# EAGLE design PIC32MX250F128B (EAGLE 8.1.0)
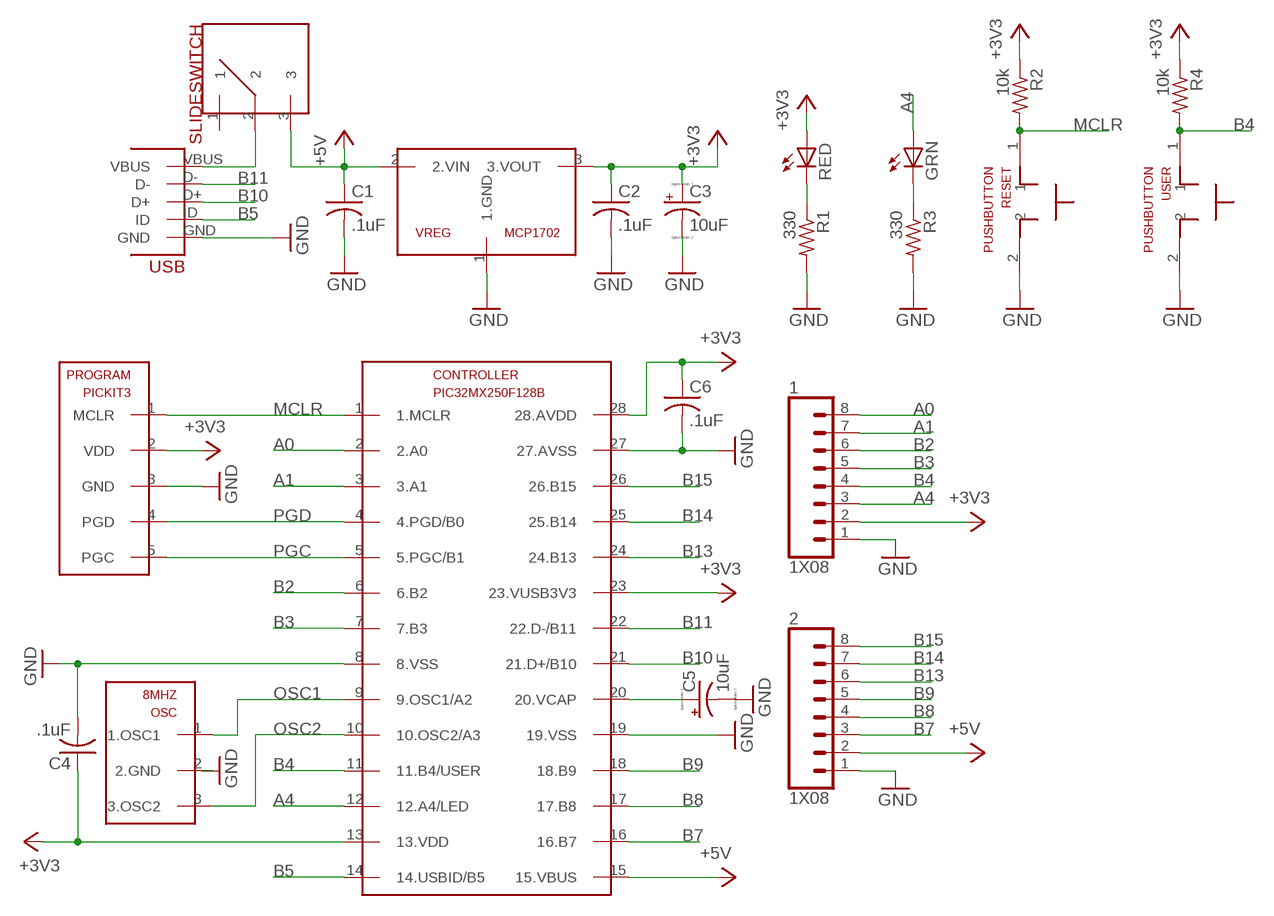
[diagram p0: schematic, sheet 1]

## Parts
1  1X08  [CONN_08]
2  1X08  [CONN_08]
8MHZ  OSC  [OSC]
C1  .1uF  C-US025-025X050  [C025-025X050]
C2  .1uF  C-US025-025X050  [C025-025X050]
C3  10uF  CPOL-USB45181B  [B45181B]
C4  .1uF  C-US025-025X050  [C025-025X050]
C5  10uF  CPOL-USB45181B  [B45181B]
C6  .1uF  C-US025-025X050  [C025-025X050]
CONTROLLER  PIC32MX250F128B  [DIL28-3]
GRN  LED3MM  [LED3MM]
PROGRAM  PICKIT3  [PICKIT3]
R1  330  R-US_0207/10  [0207/10]
R2  10k  R-US_0207/10  [0207/10]
R3  330  R-US_0207/10  [0207/10]
R4  10k  R-US_0207/10  [0207/10]
RED  LED3MM  [LED3MM]
RESET  PUSHBUTTON  [PUSHBUTTON]
SLIDESWITCH  SLIDESWITCH  [SLIDESWITCH]
USB  MINIUSB  [USB-MB-H]
USER  PUSHBUTTON  [PUSHBUTTON]
VREG  MCP1702  [TO92]

## Nets
+3V3: 1.2 C2.1 C3.+ C4.1 C6.1 CONTROLLER.13(13.VDD) CONTROLLER.23(23.VUSB3V3) CONTROLLER.28(28.AVDD) PROGRAM.2(VDD) R2.1 R4.1 RED.A VREG.3(3.VOUT)
+5V: 2.2 C1.1 CONTROLLER.15(15.VBUS) SLIDESWITCH.3 VREG.2(2.VIN)
A0: 1.8 CONTROLLER.2(2.A0)
A1: 1.7 CONTROLLER.3(3.A1)
A4: 1.3 CONTROLLER.12(12.A4/LED) GRN.A
B2: 1.6 CONTROLLER.6(6.B2)
B3: 1.5 CONTROLLER.7(7.B3)
B4: 1.4 CONTROLLER.11(11.B4/USER) R4.2 USER.1
B5: CONTROLLER.14(14.USBID/B5) USB.ID
B7: 2.3 CONTROLLER.16(16.B7)
B8: 2.4 CONTROLLER.17(17.B8)
B9: 2.5 CONTROLLER.18(18.B9)
B10: CONTROLLER.21(21.D+/B10) USB.D+
B11: CONTROLLER.22(22.D-/B11) USB.D-
B13: 2.6 CONTROLLER.24(24.B13)
B14: 2.7 CONTROLLER.25(25.B14)
B15: 2.8 CONTROLLER.26(26.B15)
GND: 1.1 2.1 8MHZ.2(2.GND) C1.2 C2.2 C3.- C4.2 C5.- C6.2 CONTROLLER.8(8.VSS) CONTROLLER.19(19.VSS) CONTROLLER.27(27.AVSS) PROGRAM.3(GND) R1.2 R3.2 RESET.2 USB.GND USER.2 VREG.1(1.GND)
MCLR: CONTROLLER.1(1.MCLR) PROGRAM.1(MCLR) R2.2 RESET.1
N$2: R1.1 RED.K(C)
N$4: GRN.K(C) R3.1
OSC1: 8MHZ.1(1.OSC1) CONTROLLER.9(9.OSC1/A2)
OSC2: 8MHZ.3(3.OSC2) CONTROLLER.10(10.OSC2/A3)
PGC: CONTROLLER.5(5.PGC/B1) PROGRAM.5(PGC)
PGD: CONTROLLER.4(4.PGD/B0) PROGRAM.4(PGD)
VBUS: SLIDESWITCH.2 USB.VBUS
VCAP: C5.+ CONTROLLER.20(20.VCAP)
Unconnected: SLIDESWITCH.1

## Library data of the parts
1 2 = HW2:1X08
8MHZ = HW2:OSC
C1 C2 C4 C6 = HW2:C-US: CAPACITOR, American symbol
C3 C5 = HW2:CPOL-US: POLARIZED CAPACITOR, American symbol
CONTROLLER = HW2:PIC32MX250F128B
GRN RED = HW2:LED: LED OSRAM: - CHIPLED LG R971, LG N971, LY N971, LG Q971, LY Q971, LO R971, LY R971 LH N974, LH R974 LS Q976, LO Q976, LY Q976 LO Q996 - Hyper CHIPLED LW Q18S LB Q993, LB Q99A, LB R99A - SideLED LS A670, LO A670, LY A670, LG A670, LP A670 LB A673, LV A673, LT A673, LW A673 LH A674 LY A675 LS A676, LA A676, LO A676, LY A676, LW A676 LS A679, LY A679, LG A679 - Hyper Micro SIDELED® LS Y876, LA Y876, LO Y876, LY Y876 LT Y87S - SmartLED LW L88C, LW L88S LB L89C, LB L89S, LG L890 LS L89K, LO L89K, LY L89K LS L896, LA L896, LO L896, LY L896 - TOPLED LS T670, LO T670, LY T670, LG T670, LP T670 LSG T670, LSP T670, LSY T670, LOP T670, LYG T670 LG T671, LOG T671, LSG T671 LB T673, LV T673, LT T673, LW T673 LH T674 LS T676, LA T676, LO T676, LY T676, LB T676, LH T676, LSB T676, LW T676 LB T67C, LV T67C, LT T67C, LS T67K, LO T67K, LY T67K, LW E67C LS E67B, LA E67B, LO E67B, LY E67B, LB E67C, LV E67C, LT E67C LW T67C LS T679, LY T679, LG T679 LS T770, LO T770, LY T770, LG T770, LP T770 LB T773, LV T773, LT T773, LW T773 LH T774 LS E675, LA E675, LY E675, LS T675 LS T776, LA T776, LO T776, LY T776, LB T776 LHGB T686 LT T68C, LB T68C - Hyper Mini TOPLED® LB M676 - Mini TOPLED Santana® LG M470 LS M47K, LO M47K, LY M47K Source: http://www.osram.convergy.de LUXEON: - LUMILED® LXK2-PW12-R00, LXK2-PW12-S00, LXK2-PW14-U00, LXK2-PW14-V00 LXK2-PM12-R00, LXK2-PM12-S00, LXK2-PM14-U00 LXK2-PE12-Q00, LXK2-PE12-R00, LXK2-PE12-S00, LXK2-PE14-T00, LXK2-PE14-U00 LXK2-PB12-K00, LXK2-PB12-L00, LXK2-PB12-M00, LXK2-PB14-N00, LXK2-PB14-P00, LXK2-PB14-Q00 LXK2-PR12-L00, LXK2-PR12-M00, LXK2-PR14-Q00, LXK2-PR14-R00 LXK2-PD12-Q00, LXK2-PD12-R00, LXK2-PD12-S00 LXK2-PH12-R00, LXK2-PH12-S00 LXK2-PL12-P00, LXK2-PL12-Q00, LXK2-PL12-R00 Source: www.luxeon.com KINGBRIGHT: KA-3528ASYC Source: www.kingbright.com
PROGRAM = HW2:PICKIT3
R1-R4 = HW2:R-US_: RESISTOR, American symbol
RESET USER = HW2:PUSHBUTTON
SLIDESWITCH = HW2:SLIDESWITCH
USB = HW2:MINIUSB
VREG = HW2:MCP1702

## Board
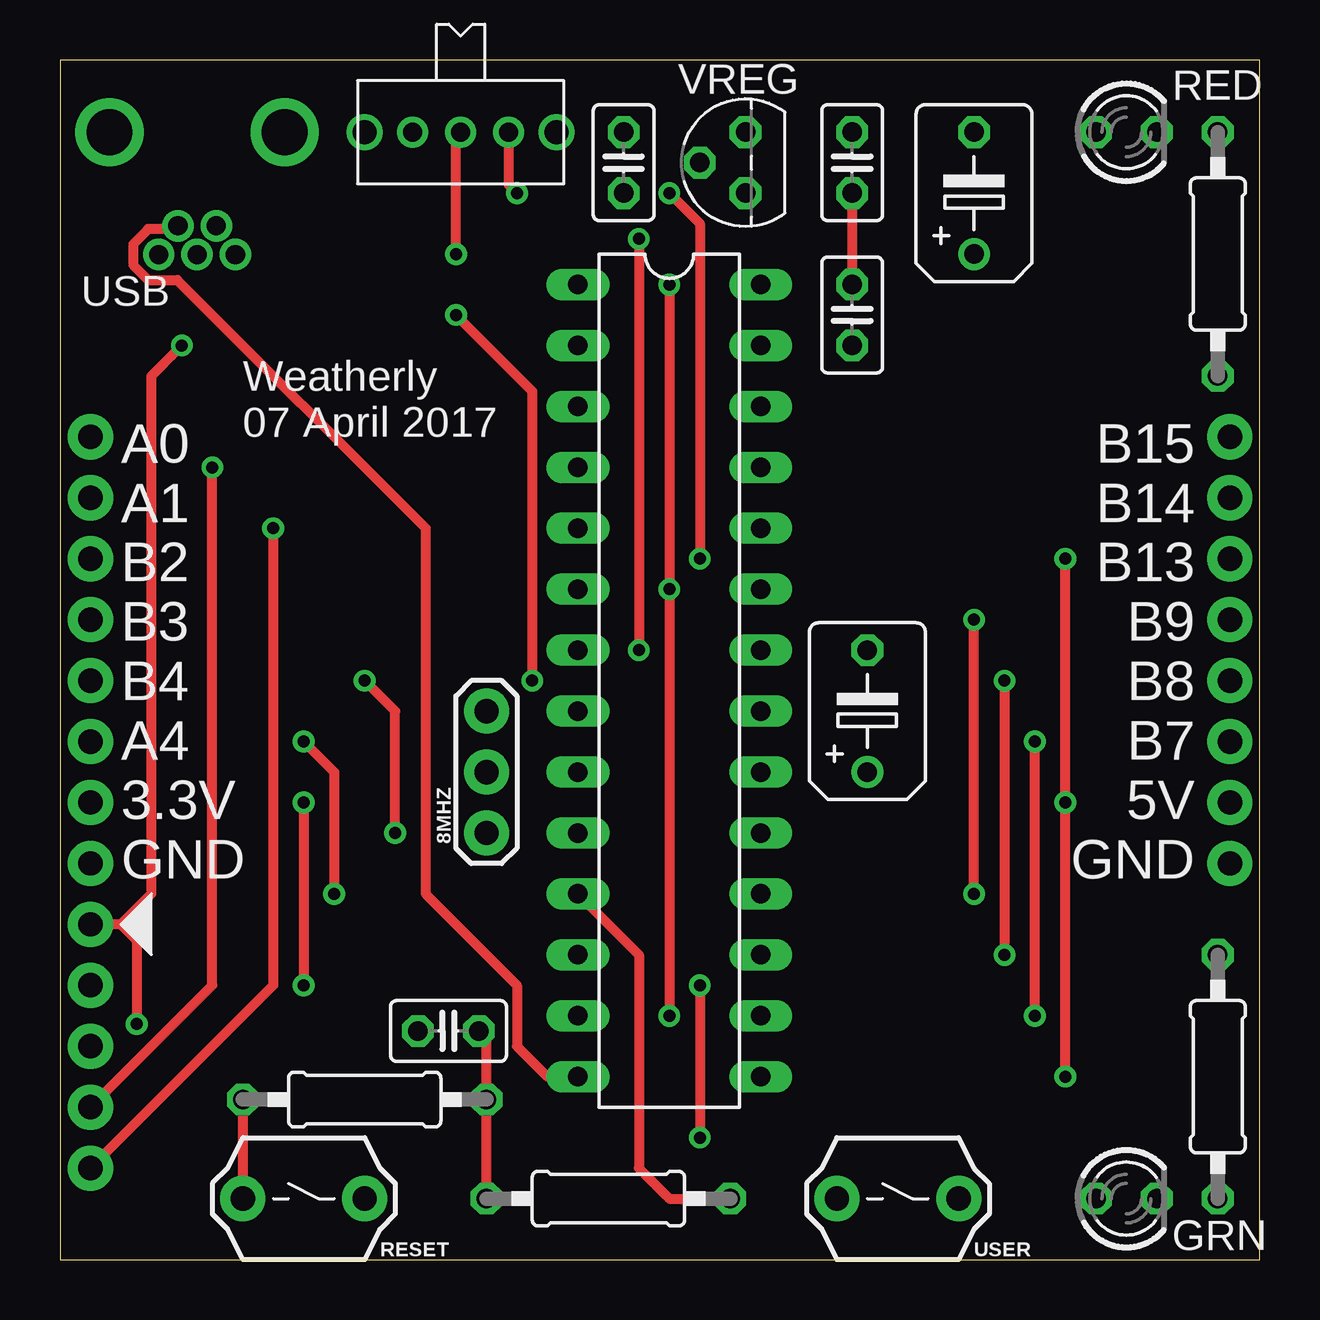
[diagram p1: board, top side]
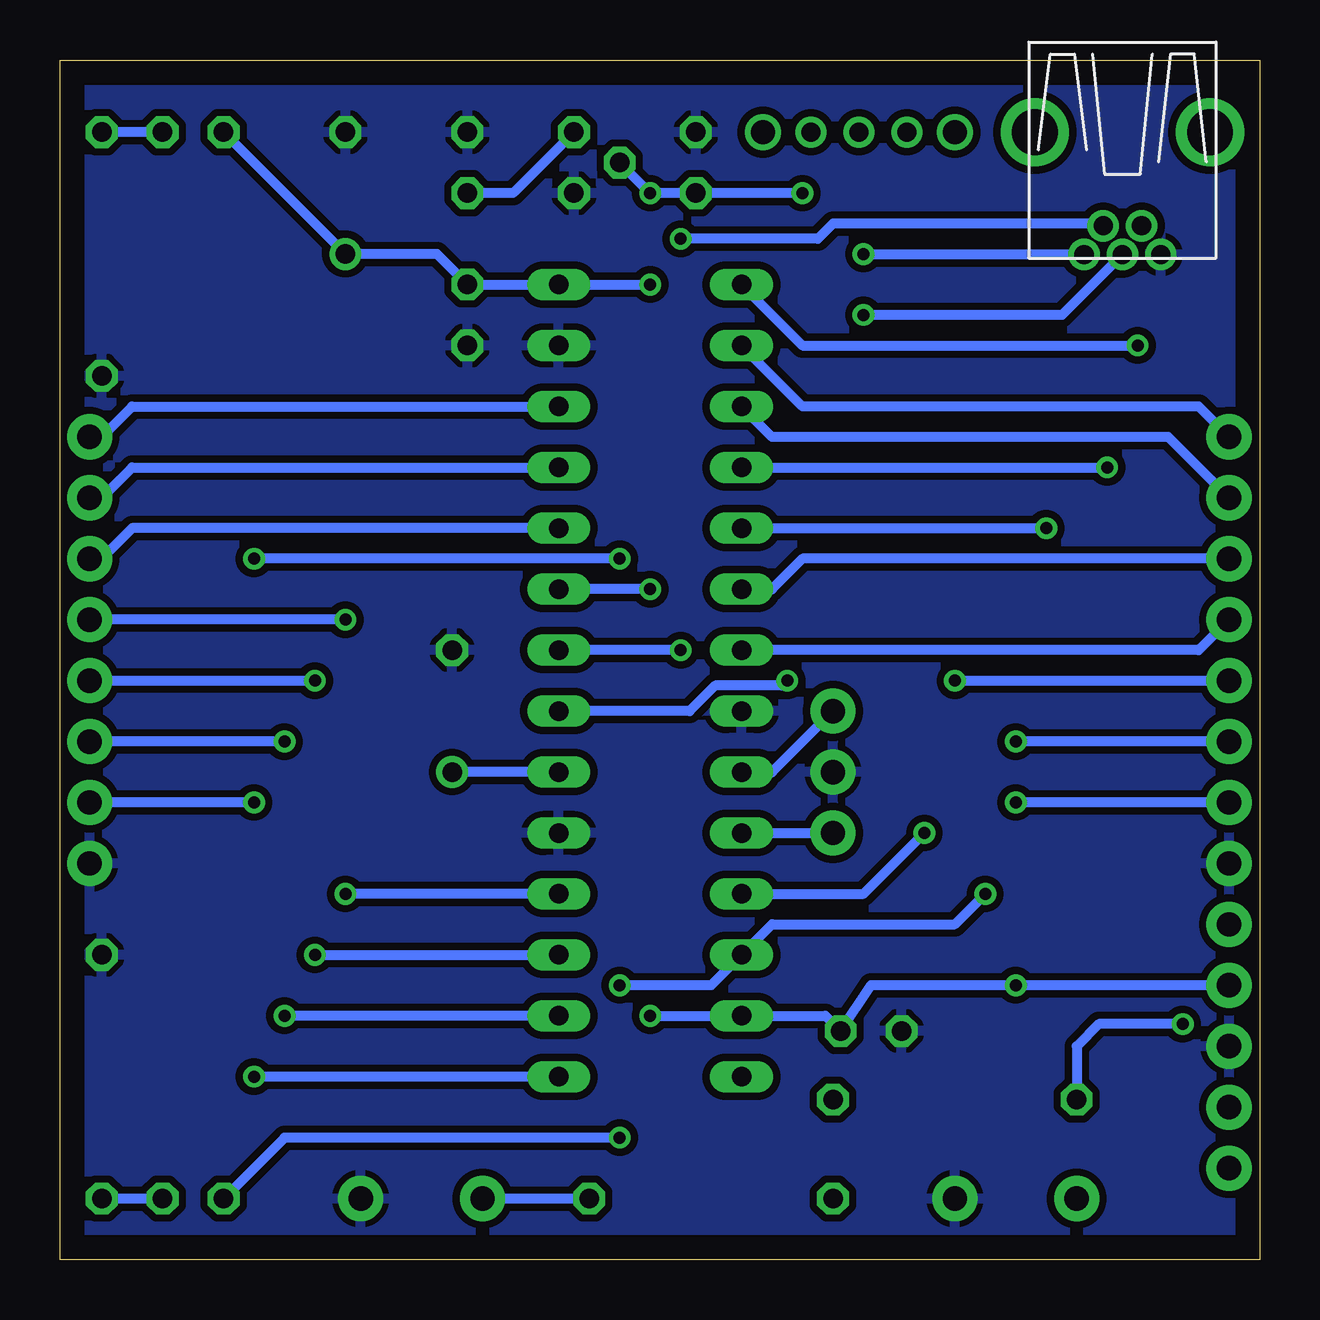
[diagram p2: board, bottom side, seen from below]

Size 50 x 50 mm. Coordinates in mm from the lower left corner, seen from the top.
Outline: 0,0 50,0 50,50 0,50 0,0
Copper layers (1*16): Top 0.035mm / dielectric 1.5mm / Bottom 0.035mm
Design rules "default": minimum track width 10mil, minimum drill 24mil, track to track 8mil, track to pad 8mil, pad to pad 8mil, via to via 8mil, smd to smd 8mil, copper to edge 40mil, drill to drill 8mil, minimum pad ring 10mil, minimum via ring 8mil, stop-mask expansion 4mil, vias tented up to drill 0mil, thermal gap 10mil

### Footprints (pad centres in the part's own frame; a part is rotated, then mirrored left to right if it is on the bottom)
CONN_08 = drill 1.016 pad 1.88: 1 0,0; 2 2.54,0; 3 5.08,0; 4 7.62,0; 5 10.16,0; 6 12.7,0; 7 15.24,0; 8 17.78,0
OSC = drill 1.016 pad 1.88: 1 0,0; 2 2.54,0; 3 5.08,0
C025-025X050 = drill 0.813 octagon: 1 -1.27,0; 2 1.27,0
B45181B = drill 0.813: + -2.54,0 | drill 0.813 octagon: - 2.54,0
DIL28-3 = drill 0.813 long: 1 -16.51,-3.81; 2 -13.97,-3.81; 3 -11.43,-3.81; 4 -8.89,-3.81; 5 -6.35,-3.81; 6 -3.81,-3.81; 7 -1.27,-3.81; 8 1.27,-3.81; 9 3.81,-3.81; 10 6.35,-3.81; 11 8.89,-3.81; 12 11.43,-3.81; 13 13.97,-3.81; 14 16.51,-3.81; 15 16.51,3.81; 16 13.97,3.81; 17 11.43,3.81; 18 8.89,3.81; 19 6.35,3.81; 20 3.81,3.81; 21 1.27,3.81; 22 -1.27,3.81; 23 -3.81,3.81; 24 -6.35,3.81; 25 -8.89,3.81; 26 -11.43,3.81; 27 -13.97,3.81; 28 -16.51,3.81
LED3MM = drill 0.813 octagon: A -1.27,0; K 1.27,0
PICKIT3 = drill 1.016 pad 1.88: 1 0,0; 2 2.54,0; 3 5.08,0; 4 7.62,0; 5 10.16,0
0207/10 = drill 0.813 octagon: 1 -5.08,0; 2 5.08,0
PUSHBUTTON = drill 1.016 pad 1.88: 1 -2.54,0; 2 2.54,0
SLIDESWITCH = drill 0.8: 1 2,0; 2 4,0; 3 6,0 | drill 1: P$1 0,0; P$2 8,0
USB-MB-H = drill 0.8: D+ 5.1,0; D- 3.9,0.8; GND 5.1,-1.6; ID 3.9,-0.8; VBUS 5.1,1.6 | drill 1.9: P$6 0,-3.65; P$7 0,3.65
TO92 = drill 0.813 octagon: 1 -1.27,0; 2 0,1.905; 3 1.27,0

### Placement (x,y rotation side)
1  1.27,16.51 90 top
2  48.77,16.51 90 top
8MHZ  17.78,22.86 270 top
C1  23.5,45.72 90 top
C2  33.02,45.72 90 top
C3  38.1,44.45 90 top
C4  16.19,9.53 180 top
C5  33.66,22.86 90 top
C6  33.02,39.37 270 top
CONTROLLER  25.4,24.13 270 top
GRN  44.45,2.54 0 top
PROGRAM  1.27,13.97 270 top
R1  48.26,41.91 270 top
R2  12.7,6.67 180 top
R3  48.26,7.62 90 top
R4  22.86,2.54 0 top
RED  44.45,46.99 0 top
RESET  10.16,2.54 0 top
SLIDESWITCH  12.7,46.99 0 top
USB  5.71,46.99 270 top
USER  34.92,2.54 0 top
VREG  28.57,45.72 90 top

### Tracks (layer width: path | path; a pad name or v marks a point on that pad's centre or on a via)
+3V3  (via drill 0.5)
  Top 0.406: C2.1 C6.1 | v25.4,40.64 v25.4,27.94 v25.4,10.16 | R4.1 R2.1 17.78,9.21 C4.1 | v10.16,19.05 v10.16,11.43
  Bottom 0.406: VREG.3 31.11,44.45 C2.1 | RED.A C3.+ 34.29,41.91 C6.1 CONTROLLER.28 v25.4,40.64 | v25.4,27.94 CONTROLLER.23 | v25.4,10.16 CONTROLLER.13 18.1,10.16 C4.1 16.19,11.43 v10.16,11.43 PROGRAM.2 | 1.2 v10.16,19.05
+5V  (via drill 0.5)
  Top 0.406: SLIDESWITCH.3 18.7,44.8 v19.05,44.45 | v25.4,44.45 26.67,43.18 v26.67,29.21 | v41.91,29.21 v41.91,19.05 v41.91,7.62
  Bottom 0.406: v19.05,44.45 C1.1 v25.4,44.45 VREG.2 | v26.67,29.21 v41.91,29.21 | v41.91,19.05 2.2 | CONTROLLER.15 v41.91,7.62
A0
  Bottom 0.406: 1.8 2.54,35.56 19.05,35.56 CONTROLLER.2
A1
  Bottom 0.406: 1.7 3.81,34.29 20.32,34.29 CONTROLLER.3
A4  (via drill 0.5)
  Top 0.406: v26.67,11.43 v26.67,5.08 | v10.16,21.59 11.43,20.32 v11.43,15.24
  Bottom 0.406: v26.67,11.43 22.86,11.43 CONTROLLER.12 20.32,13.97 12.7,13.97 v11.43,15.24 | v26.67,5.08 40.64,5.08 GRN.A | 1.3 v10.16,21.59
B2
  Bottom 0.406: 1.6 19.05,29.21 20.32,27.94 CONTROLLER.6
B3
  Bottom 0.406: 1.5 2.54,25.4 CONTROLLER.7
B4  (via drill 0.5)
  Top 0.406: CONTROLLER.11 24.13,12.7 24.13,3.81 25.4,2.54 R4.2 | v13.97,17.78 13.97,22.86 v12.7,24.13
  Bottom 0.406: R4.2 USER.1 | CONTROLLER.11 16.51,15.24 v13.97,17.78 | v12.7,24.13 1.4
B5
  Top 0.406: USB.ID 4.78,42.95 3.68,42.95 3.06,42.33 3.06,41.45 3.68,40.83 4.89,40.83 15.24,30.48 15.24,15.24 19.05,11.43 19.05,8.89 20.32,7.62 CONTROLLER.14
B7  (via drill 0.5)
  Top 0.406: v40.64,10.16 v40.64,21.59
  Bottom 0.406: CONTROLLER.16 v40.64,10.16 | v40.64,21.59 2.3
B8  (via drill 0.5)
  Top 0.406: v39.37,24.13 v39.37,12.7
  Bottom 0.406: 2.4 v39.37,24.13 | v39.37,12.7 CONTROLLER.17
B9  (via drill 0.5)
  Top 0.406: v38.1,15.24 v38.1,26.67
  Bottom 0.406: CONTROLLER.18 v38.1,15.24 | v38.1,26.67 2.5
B10  (via drill 0.5)
  Top 0.406: v16.51,39.37 19.68,36.2 v19.68,24.13
  Bottom 0.406: USB.D+ 8.23,39.37 v16.51,39.37 | v19.68,24.13 19.89,23.93 22.69,23.93 23.76,22.86 CONTROLLER.21
B11  (via drill 0.5)
  Top 0.406: v24.13,42.55 v24.13,25.4
  Bottom 0.406: USB.D- 6.61,43.18 17.78,43.18 18.41,42.55 v24.13,42.55 | v24.13,25.4 CONTROLLER.22
B13
  Bottom 0.406: CONTROLLER.24 46.99,30.48 48.26,29.21 2.6
B14
  Bottom 0.406: 2.7 48.26,31.75 46.99,33.02 CONTROLLER.25
B15
  Bottom 0.406: 2.8 48.26,34.29 46.99,35.56 CONTROLLER.26
GND
  pour Bottom (isolate 0.305): 0,50 50,50 50,0 0,0
MCLR  (via drill 0.5)
  Top 0.406: v5.08,38.1 3.81,36.83 3.81,15.24 2.54,13.97 | R2.2 RESET.1 | 2.54,13.97 PROGRAM.1 | 2.54,13.97 3.2,13.31 v3.2,9.81
  Bottom 0.406: CONTROLLER.1 19.05,38.1 v5.08,38.1 | v3.2,9.81 6.7,9.81 7.62,8.89 R2.2
N$2
  Bottom 0.406: RED.K R1.1
N$4
  Bottom 0.406: GRN.K R3.1
OSC1
  Bottom 0.406: CONTROLLER.9 20.32,20.32 8MHZ.1
OSC2
  Bottom 0.406: CONTROLLER.10 8MHZ.3
PGC  (via drill 0.5)
  Top 0.406: v8.89,30.48 8.89,12.7 | 8.89,12.7 8.89,12.3 | 8.89,12.7 8.89,11.43 PROGRAM.5
  Bottom 0.406: CONTROLLER.5 v8.89,30.48
PGD  (via drill 0.5)
  Top 0.406: PROGRAM.4 6.35,11.43 v6.35,33.02
  Bottom 0.406: CONTROLLER.4 v6.35,33.02
VBUS  (via drill 0.5)
  Top 0.406: v16.51,41.91 16.51,46.8 SLIDESWITCH.2
  Bottom 0.406: USB.VBUS 16.49,41.89 v16.51,41.91
VCAP
  Bottom 0.406: CONTROLLER.20 C5.+

### Text on the board
tPlace: Weatherly / 07 April 2017 | A0 / A1 / B2 / B3 / B4 / A4 / 3.3V / GND | B15 / B14 / B13 / B9 / B8 / B7 / 5V / GND